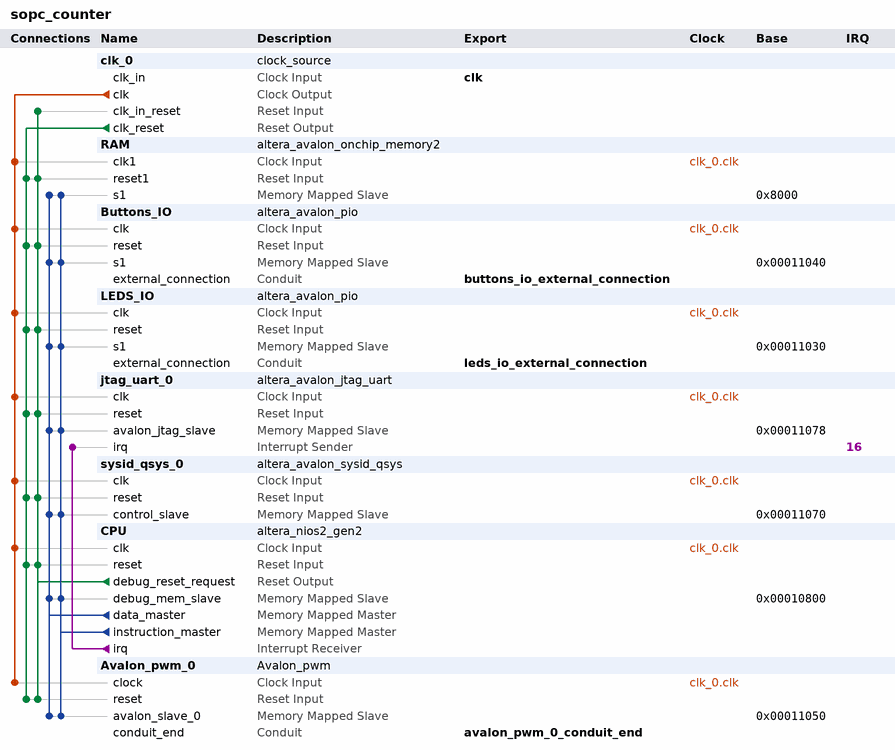
[diagram p0: system contents]
# Platform Designer (Qsys) system sopc_counter, Cyclone IV E EP4CE22F17C6
# Parameters at their usual value, and those the tool derives, are not listed.
package require -exact qsys 18.1
create_system sopc_counter
set_project_property DEVICE_FAMILY {Cyclone IV E}
set_project_property DEVICE EP4CE22F17C6

add_instance clk_0 clock_source 18.1
set_instance_parameter_value clk_0 clockFrequency 50000000

add_instance RAM altera_avalon_onchip_memory2 18.1
set_instance_parameter_value RAM dataWidth 32
set_instance_parameter_value RAM dualPort false
set_instance_parameter_value RAM initMemContent true
set_instance_parameter_value RAM initializationFileName onchip_mem.hex
set_instance_parameter_value RAM memorySize 20480

add_instance Buttons_IO altera_avalon_pio 18.1
set_instance_parameter_value Buttons_IO direction Input
set_instance_parameter_value Buttons_IO width 2

add_instance LEDS_IO altera_avalon_pio 18.1
set_instance_parameter_value LEDS_IO direction Output
set_instance_parameter_value LEDS_IO width 8

add_instance jtag_uart_0 altera_avalon_jtag_uart 18.1
set_instance_parameter_value jtag_uart_0 simInteractiveOptions NO_INTERACTIVE_WINDOWS

add_instance sysid_qsys_0 altera_avalon_sysid_qsys 18.1
set_instance_parameter_value sysid_qsys_0 id 0

add_instance CPU altera_nios2_gen2 18.1
set_instance_parameter_value CPU dcache_size 2048
set_instance_parameter_value CPU exceptionSlave RAM.s1
set_instance_parameter_value CPU icache_size 4096
set_instance_parameter_value CPU impl Tiny
set_instance_parameter_value CPU resetSlave RAM.s1

add_instance Avalon_pwm_0 Avalon_pwm 1.0

# connections
add_connection clk_0.clk Avalon_pwm_0.clock clock
add_connection clk_0.clk Buttons_IO.clk clock
add_connection clk_0.clk CPU.clk clock
add_connection clk_0.clk jtag_uart_0.clk clock
add_connection clk_0.clk LEDS_IO.clk clock
add_connection clk_0.clk RAM.clk1 clock
add_connection clk_0.clk sysid_qsys_0.clk clock
add_connection clk_0.clk_reset Avalon_pwm_0.reset reset
add_connection clk_0.clk_reset Buttons_IO.reset reset
add_connection clk_0.clk_reset CPU.reset reset
add_connection clk_0.clk_reset jtag_uart_0.reset reset
add_connection clk_0.clk_reset LEDS_IO.reset reset
add_connection clk_0.clk_reset RAM.reset1 reset
add_connection clk_0.clk_reset sysid_qsys_0.reset reset
add_connection CPU.debug_reset_request Avalon_pwm_0.reset reset
add_connection CPU.debug_reset_request Buttons_IO.reset reset
add_connection CPU.debug_reset_request clk_0.clk_in_reset reset
add_connection CPU.debug_reset_request CPU.reset reset
add_connection CPU.debug_reset_request jtag_uart_0.reset reset
add_connection CPU.debug_reset_request LEDS_IO.reset reset
add_connection CPU.debug_reset_request RAM.reset1 reset
add_connection CPU.debug_reset_request sysid_qsys_0.reset reset
add_connection CPU.data_master Avalon_pwm_0.avalon_slave_0 avalon
set_connection_parameter_value CPU.data_master/Avalon_pwm_0.avalon_slave_0 baseAddress 0x00011050
add_connection CPU.data_master Buttons_IO.s1 avalon
set_connection_parameter_value CPU.data_master/Buttons_IO.s1 baseAddress 0x00011040
add_connection CPU.data_master CPU.debug_mem_slave avalon
set_connection_parameter_value CPU.data_master/CPU.debug_mem_slave baseAddress 0x00010800
add_connection CPU.data_master jtag_uart_0.avalon_jtag_slave avalon
set_connection_parameter_value CPU.data_master/jtag_uart_0.avalon_jtag_slave baseAddress 0x00011078
add_connection CPU.data_master LEDS_IO.s1 avalon
set_connection_parameter_value CPU.data_master/LEDS_IO.s1 baseAddress 0x00011030
add_connection CPU.data_master RAM.s1 avalon
set_connection_parameter_value CPU.data_master/RAM.s1 baseAddress 0x8000
add_connection CPU.data_master sysid_qsys_0.control_slave avalon
set_connection_parameter_value CPU.data_master/sysid_qsys_0.control_slave baseAddress 0x00011070
add_connection CPU.instruction_master Avalon_pwm_0.avalon_slave_0 avalon
set_connection_parameter_value CPU.instruction_master/Avalon_pwm_0.avalon_slave_0 baseAddress 0x00011050
add_connection CPU.instruction_master Buttons_IO.s1 avalon
set_connection_parameter_value CPU.instruction_master/Buttons_IO.s1 baseAddress 0x00011040
add_connection CPU.instruction_master CPU.debug_mem_slave avalon
set_connection_parameter_value CPU.instruction_master/CPU.debug_mem_slave baseAddress 0x00010800
add_connection CPU.instruction_master jtag_uart_0.avalon_jtag_slave avalon
set_connection_parameter_value CPU.instruction_master/jtag_uart_0.avalon_jtag_slave baseAddress 0x00011078
add_connection CPU.instruction_master LEDS_IO.s1 avalon
set_connection_parameter_value CPU.instruction_master/LEDS_IO.s1 baseAddress 0x00011030
add_connection CPU.instruction_master RAM.s1 avalon
set_connection_parameter_value CPU.instruction_master/RAM.s1 baseAddress 0x8000
add_connection CPU.instruction_master sysid_qsys_0.control_slave avalon
set_connection_parameter_value CPU.instruction_master/sysid_qsys_0.control_slave baseAddress 0x00011070
add_connection CPU.irq jtag_uart_0.irq interrupt
set_connection_parameter_value CPU.irq/jtag_uart_0.irq irqNumber 16

# exported interfaces
add_interface avalon_pwm_0_conduit_end conduit end
set_interface_property avalon_pwm_0_conduit_end EXPORT_OF Avalon_pwm_0.conduit_end
add_interface buttons_io_external_connection conduit end
set_interface_property buttons_io_external_connection EXPORT_OF Buttons_IO.external_connection
add_interface clk clock sink
set_interface_property clk EXPORT_OF clk_0.clk_in
add_interface leds_io_external_connection conduit end
set_interface_property leds_io_external_connection EXPORT_OF LEDS_IO.external_connection

set_interconnect_requirement {$system} qsys_mm.clockCrossingAdapter HANDSHAKE
set_interconnect_requirement {$system} qsys_mm.enableEccProtection FALSE
set_interconnect_requirement {$system} qsys_mm.insertDefaultSlave FALSE
set_interconnect_requirement {$system} qsys_mm.maxAdditionalLatency 1

save_system sopc_counter.qsys
